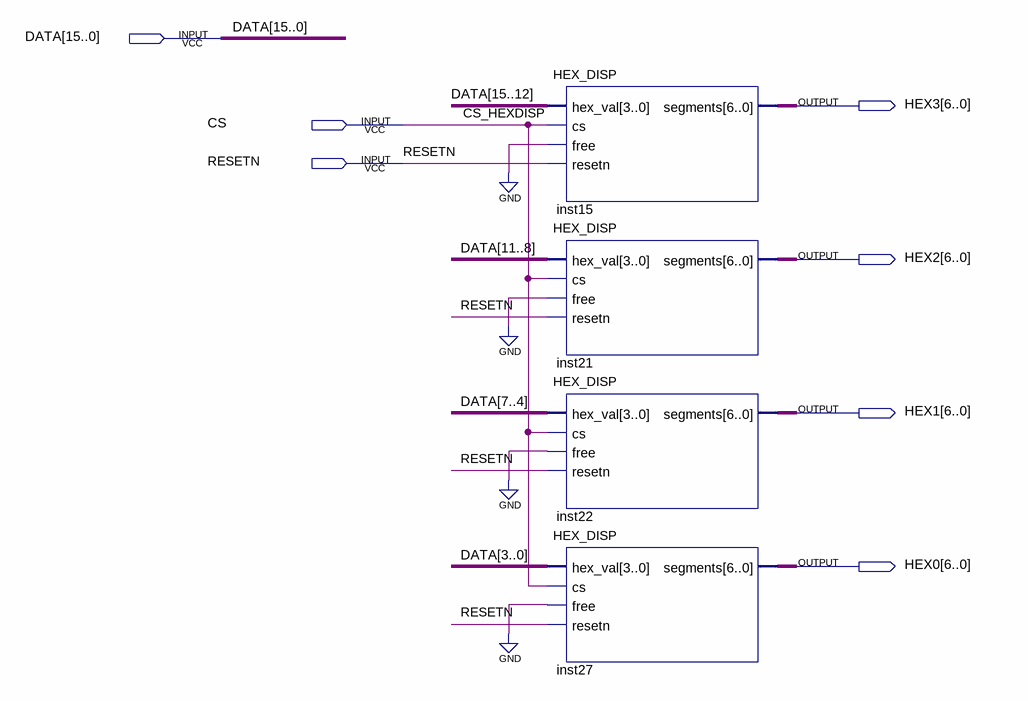
[diagram p0: schematic sheet]
// Quartus schematic QUAD_HEX.bdf as structural Verilog: 4 symbols, 7 pins
module QUAD_HEX (
  input  [15:0] DATA,
  input  CS,
  input  RESETN,
  output [6:0] HEX3,
  output [6:0] HEX2,
  output [6:0] HEX1,
  output [6:0] HEX0
);

  HEX_DISP inst15 (.hex_val(DATA[15:12]), .cs(CS), .free(1'b0), .resetn(RESETN), .segments(HEX3));
  HEX_DISP inst21 (.hex_val(DATA[11:8]), .cs(CS), .free(1'b0), .resetn(RESETN), .segments(HEX2));
  HEX_DISP inst22 (.hex_val(DATA[7:4]), .cs(CS), .free(1'b0), .resetn(RESETN), .segments(HEX1));
  HEX_DISP inst27 (.hex_val(DATA[3:0]), .cs(CS), .free(1'b0), .resetn(RESETN), .segments(HEX0));

  // Other names for the same wires on the sheet: CS_HEXDISP = CS
endmodule
